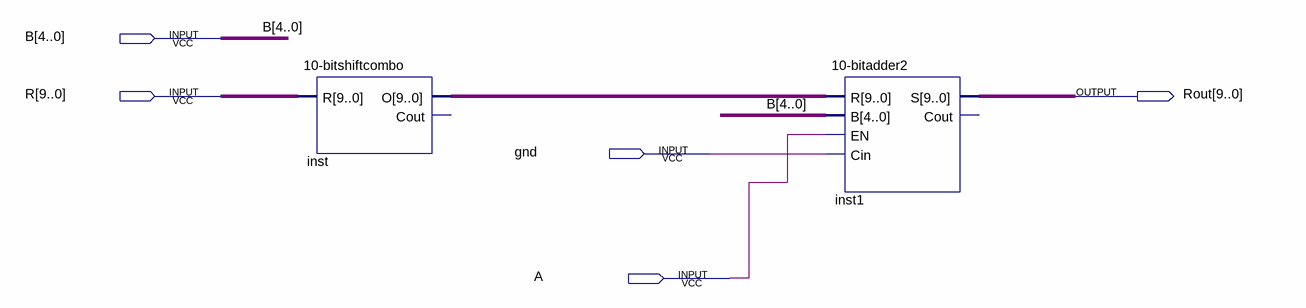
[diagram p0: schematic sheet]
// Quartus schematic xstage0.bdf as structural Verilog: 2 symbols, 5 pins
module xstage0 (
  input  [4:0] B,
  input  [9:0] R,
  input  gnd,
  input  A,
  output [9:0] Rout
);

  wire [9:0] inst_o;

  \10-bitshiftcombo  inst (.R(R), .O(inst_o));  // open: Cout
  \10-bitadder2  inst1 (.R(inst_o), .B(B), .EN(A), .Cin(gnd), .S(Rout));  // open: Cout
endmodule
